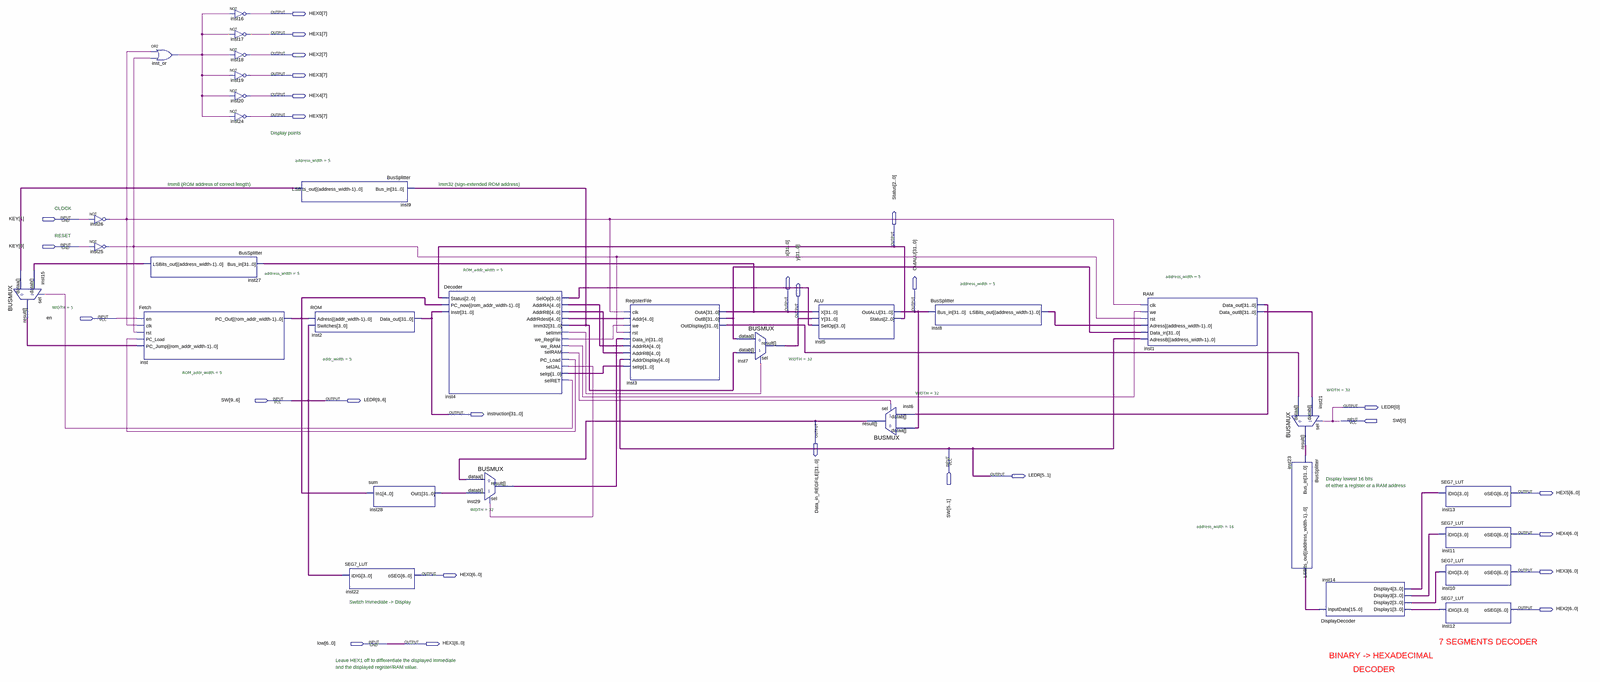
[diagram p0: schematic sheet, whole]
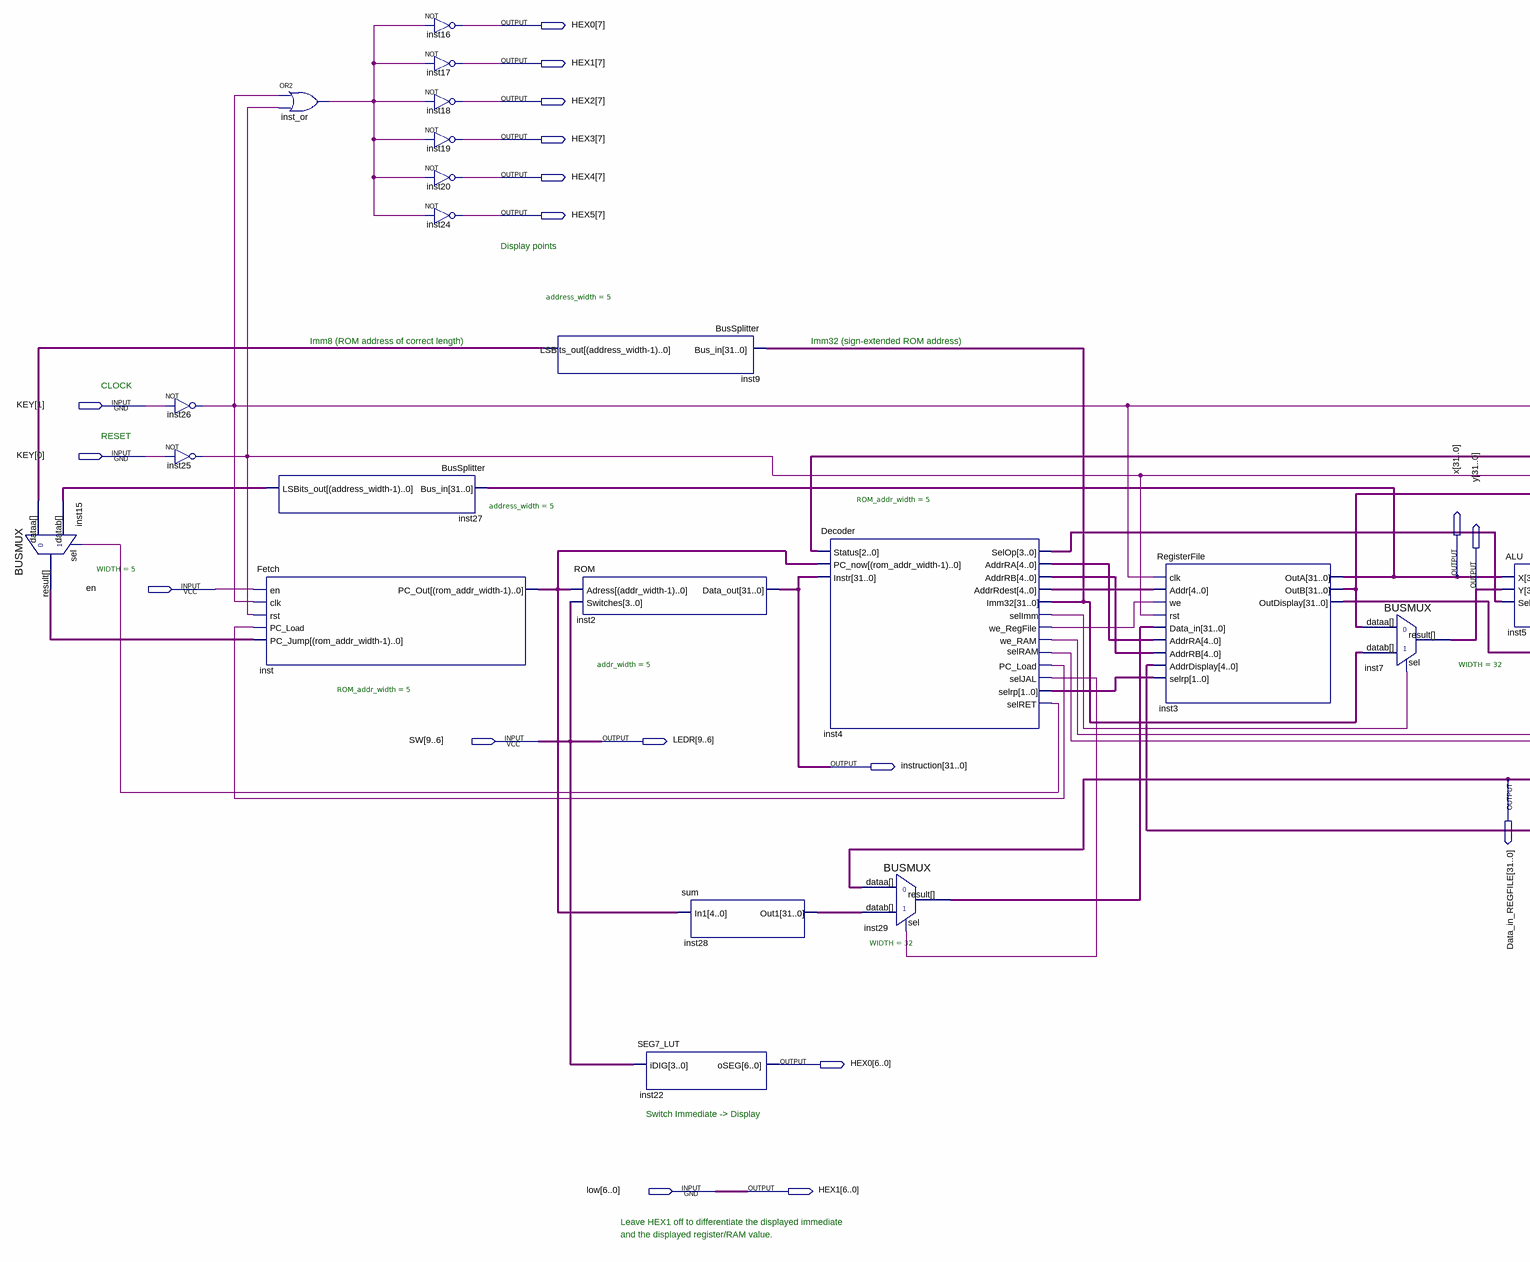
[diagram p1: schematic sheet, left part]
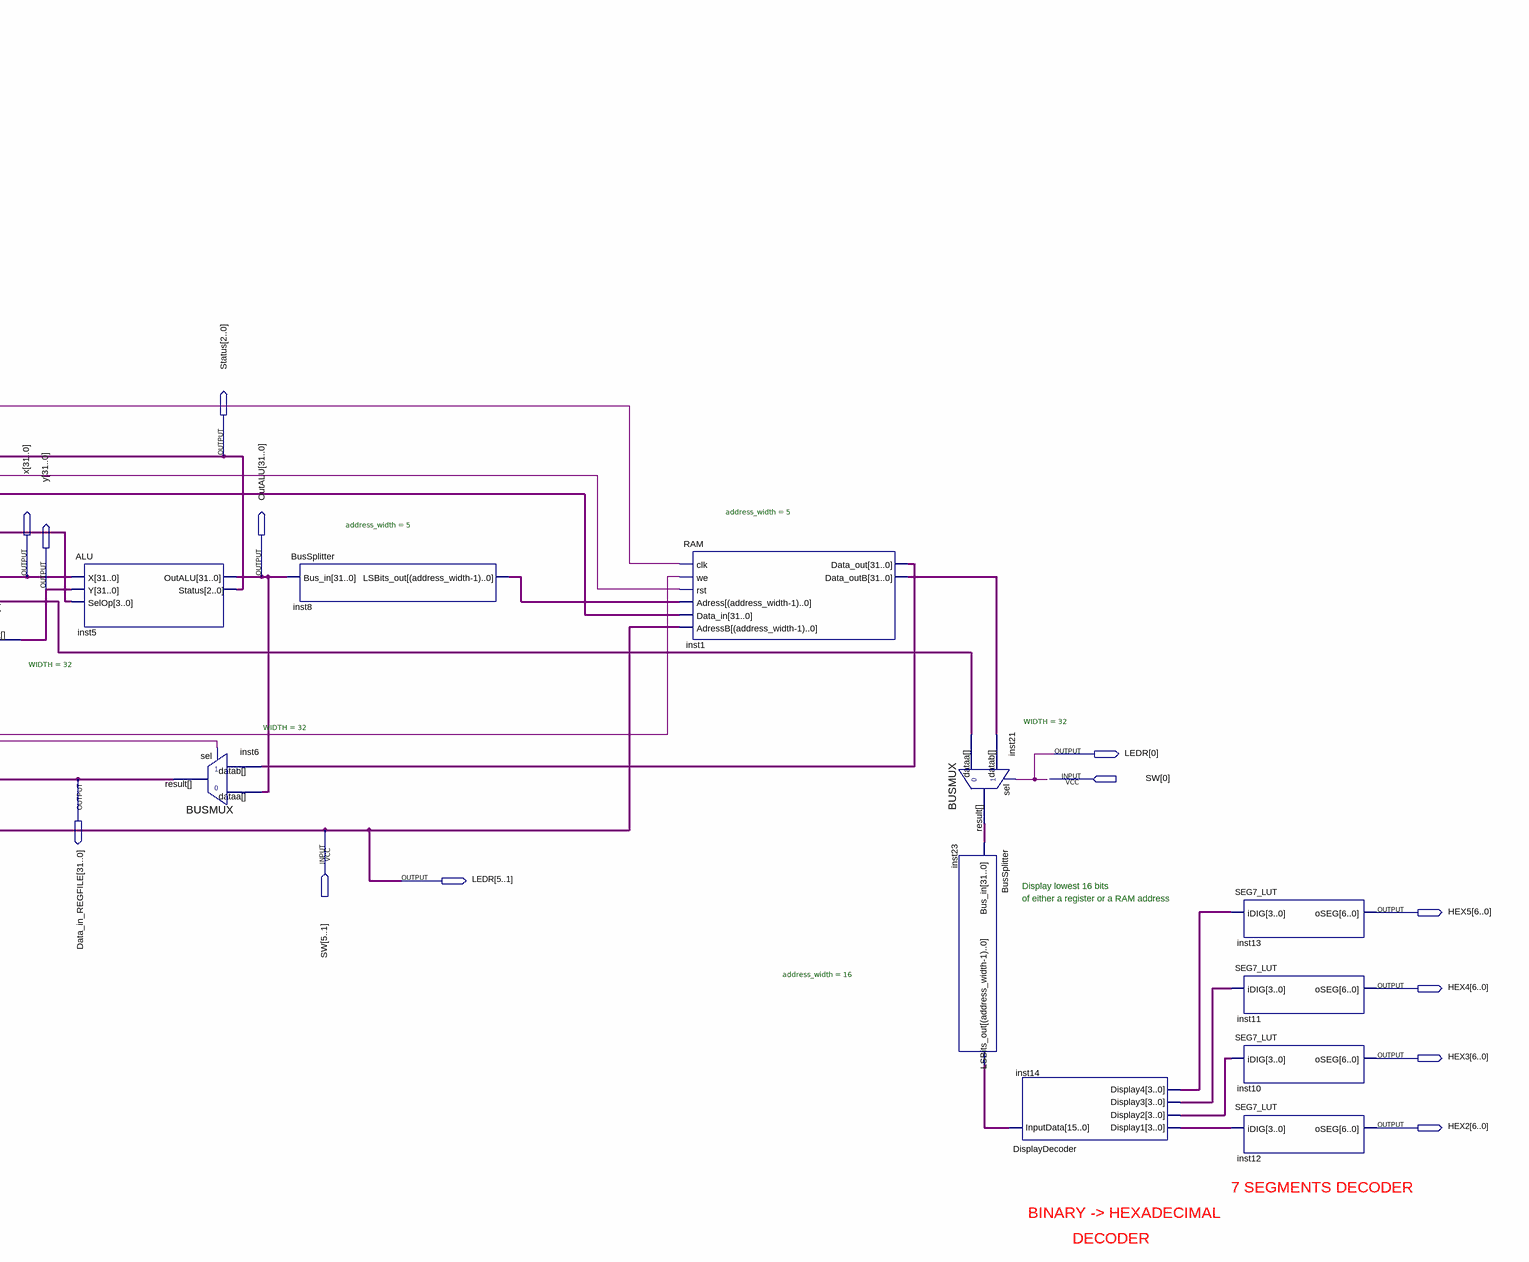
[diagram p2: schematic sheet, right part]
// Quartus schematic SingleCycleCPU.bdf as structural Verilog: 31 symbols, 28 pins
module SingleCycleCPU (
  input  [1:0] KEY,
  input  en,
  input  [9:0] SW,
  input  [6:0] low,
  output [7:0] HEX0,
  output [7:0] HEX1,
  output [7:0] HEX2,
  output [7:0] HEX3,
  output [7:0] HEX4,
  output [7:0] HEX5,
  output [2:0] Status,
  output [31:0] x,
  output [31:0] OutALU,
  output [31:0] y,
  output [9:0] LEDR,
  output [31:0] instruction,
  output [31:0] Data_in_REGFILE
);

  wire inst4_pc_load, inst4_selimm, inst4_seljal, inst4_selram, inst4_selret, inst4_we_ram, inst4_we_regfile,
       inst25_out, inst26_out, inst_or_out;
  wire [1:0] inst4_selrp;
  wire [3:0] inst4_selop, inst14_display1, inst14_display2, inst14_display3, inst14_display4;
  wire [4:0] inst4_addrra, inst4_addrrb, inst4_addrrdest, inst8_lsbits_out, inst9_lsbits_out, inst15_result,
       inst27_lsbits_out, inst_pc_out;
  wire [15:0] inst23_lsbits_out;
  wire [31:0] inst1_data_out, inst1_data_outb, inst3_outb, inst3_outdisplay, inst4_imm32, inst21_result,
       inst28_out1, inst29_result;

  BUSMUX #(.WIDTH(5)) inst15 (
    .datab(inst27_lsbits_out), .sel(inst4_selret), .dataa(inst9_lsbits_out), .result(inst15_result));
  not inst26 (inst26_out, KEY[1]);
  not inst25 (inst25_out, KEY[0]);
  BusSplitter #(.address_width(5)) inst27 (.Bus_in(x), .LSBits_out(inst27_lsbits_out));
  Fetch #(.ROM_addr_width(5)) inst (
    .en(en), .clk(inst26_out), .rst(inst25_out), .PC_Load(inst4_pc_load), .PC_Jump(inst15_result),
    .PC_Out(inst_pc_out));
  or inst_or (inst_or_out, inst26_out, inst25_out);
  not inst16 (HEX0[7], inst_or_out);
  not inst17 (HEX1[7], inst_or_out);
  not inst18 (HEX2[7], inst_or_out);
  not inst19 (HEX3[7], inst_or_out);
  not inst20 (HEX4[7], inst_or_out);
  not inst24 (HEX5[7], inst_or_out);
  BusSplitter #(.address_width(5)) inst9 (.Bus_in(inst4_imm32), .LSBits_out(inst9_lsbits_out));
  ROM #(.addr_width(5)) inst2 (.Adress(inst_pc_out), .Switches(SW[9:6]), .Data_out(instruction));
  SEG7_LUT inst22 (.iDIG(SW[9:6]), .oSEG(HEX0[6:0]));
  sum inst28 (.In1(inst_pc_out), .Out1(inst28_out1));
  Decoder #(.ROM_addr_width(5)) inst4 (
    .Status(Status), .PC_now(inst_pc_out), .Instr(instruction), .SelOp(inst4_selop), .AddrRA(inst4_addrra),
    .AddrRB(inst4_addrrb), .AddrRdest(inst4_addrrdest), .Imm32(inst4_imm32), .selImm(inst4_selimm),
    .selRAM(inst4_selram), .selRET(inst4_selret), .we_RegFile(inst4_we_regfile), .we_RAM(inst4_we_ram),
    .PC_Load(inst4_pc_load), .selrp(inst4_selrp), .selJAL(inst4_seljal));
  BUSMUX #(.WIDTH(32)) inst29 (
    .datab(inst28_out1), .sel(inst4_seljal), .dataa(Data_in_REGFILE), .result(inst29_result));
  RegisterFile inst3 (
    .clk(inst26_out), .Addr(inst4_addrrdest), .we(inst4_we_regfile), .rst(inst25_out),
    .Data_in(inst29_result), .AddrRA(inst4_addrra), .AddrRB(inst4_addrrb), .selrp(inst4_selrp),
    .AddrDisplay(SW[5:1]), .OutA(x), .OutB(inst3_outb), .OutDisplay(inst3_outdisplay));
  BUSMUX #(.WIDTH(32)) inst7 (.datab(inst4_imm32), .sel(inst4_selimm), .dataa(inst3_outb), .result(y));
  ALU inst5 (.X(x), .Y(y), .SelOp(inst4_selop), .OutALU(OutALU), .Status(Status));
  BUSMUX #(.WIDTH(32)) inst6 (.datab(inst1_data_out), .sel(inst4_selram), .dataa(OutALU), .result(Data_in_REGFILE));
  BusSplitter #(.address_width(5)) inst8 (.Bus_in(OutALU), .LSBits_out(inst8_lsbits_out));
  RAM #(.address_width(5)) inst1 (
    .clk(inst26_out), .we(inst4_we_ram), .rst(inst25_out), .Adress(inst8_lsbits_out), .AdressB(SW[5:1]),
    .Data_in(inst3_outb), .Data_out(inst1_data_out), .Data_outB(inst1_data_outb));
  BUSMUX #(.WIDTH(32)) inst21 (.datab(inst1_data_outb), .sel(SW[0]), .dataa(inst3_outdisplay), .result(inst21_result));
  BusSplitter #(.address_width(16)) inst23 (.Bus_in(inst21_result), .LSBits_out(inst23_lsbits_out));
  DisplayDecoder inst14 (
    .InputData(inst23_lsbits_out), .Display1(inst14_display1), .Display2(inst14_display2),
    .Display3(inst14_display3), .Display4(inst14_display4));
  SEG7_LUT inst13 (.iDIG(inst14_display4), .oSEG(HEX5[6:0]));
  SEG7_LUT inst11 (.iDIG(inst14_display3), .oSEG(HEX4[6:0]));
  SEG7_LUT inst10 (.iDIG(inst14_display2), .oSEG(HEX3[6:0]));
  SEG7_LUT inst12 (.iDIG(inst14_display1), .oSEG(HEX2[6:0]));

  assign HEX1[6:0] = low;
  assign LEDR = SW;

  // Notes on the sheet:
  //   Display points
  //   Imm8 (ROM address of correct length)
  //   Imm32 (sign-extended ROM address)
  //   CLOCK
  //   RESET
  //   Display lowest 16 bits
  //   of either a register or a RAM address
  //   Switch Immediate -> Display
  //   7 SEGMENTS DECODER
  //   BINARY -> HEXADECIMAL
  //   Leave HEX1 off to differentiate the displayed immediate
  //   and the displayed register/RAM value.
  //   DECODER
endmodule
